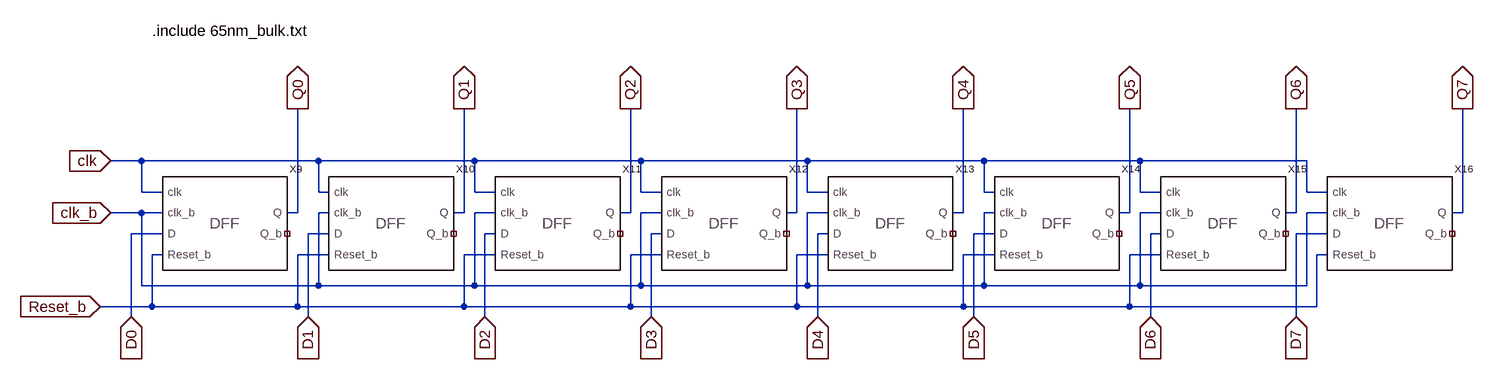
[diagram p0: schematic pipo_reg_new.asc]
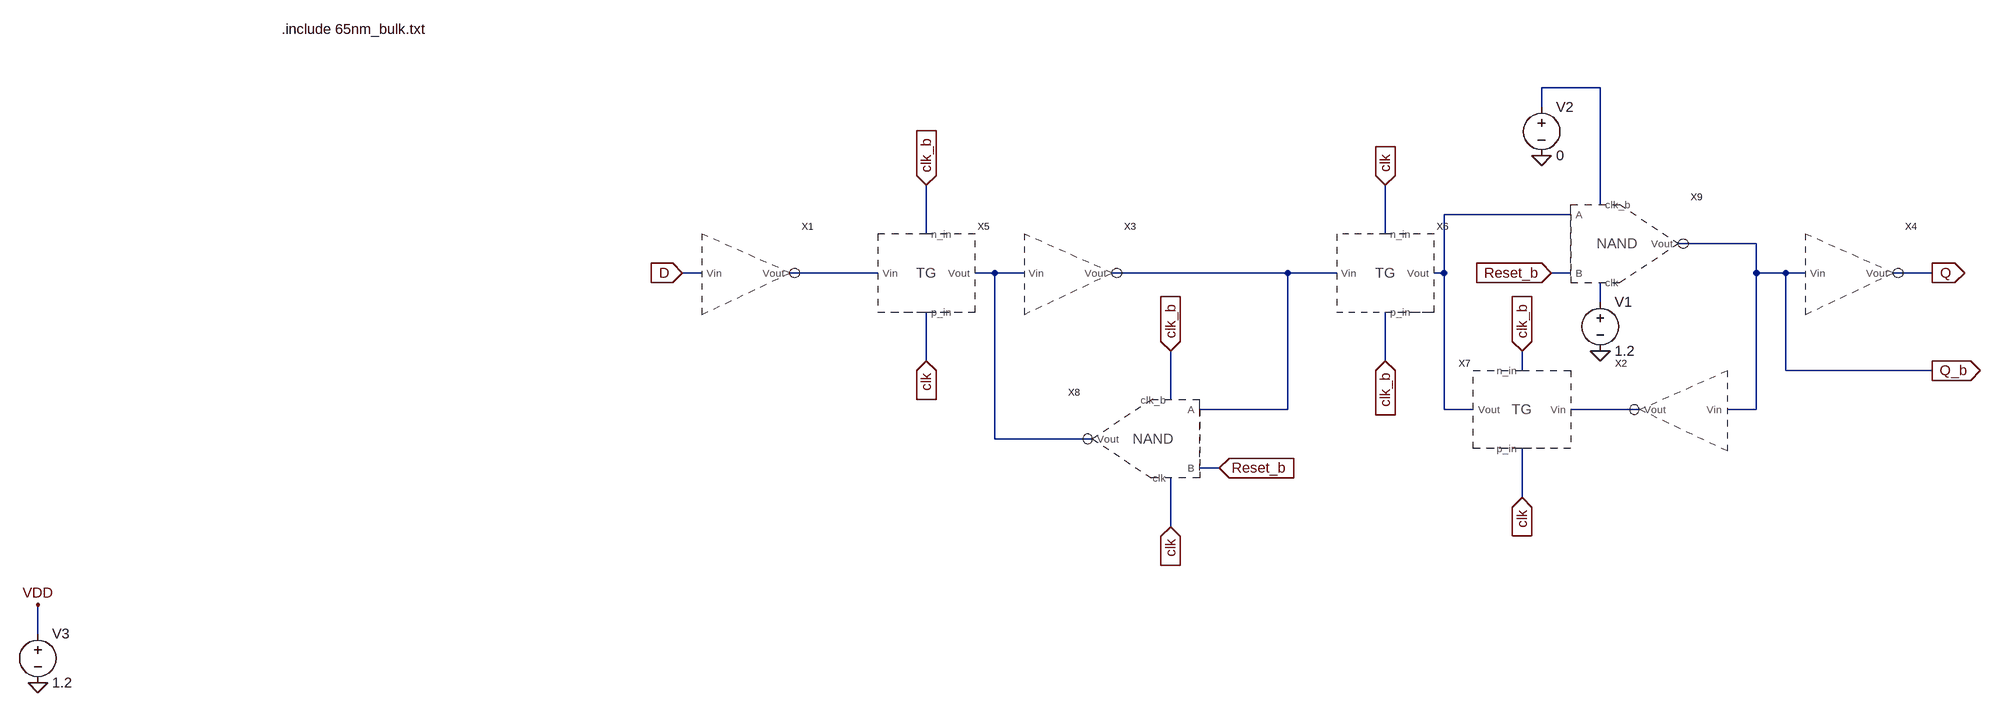
[diagram p1: sub-circuit def_res_sym_2.asc]
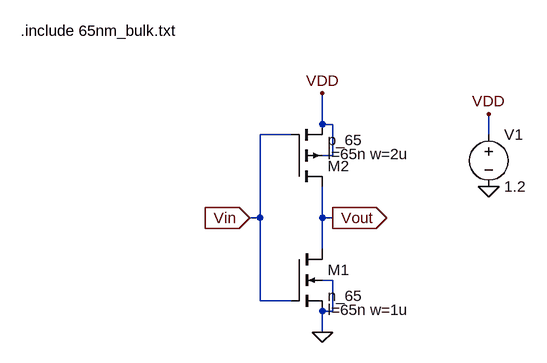
[diagram p2: sub-circuit inverter.asc]
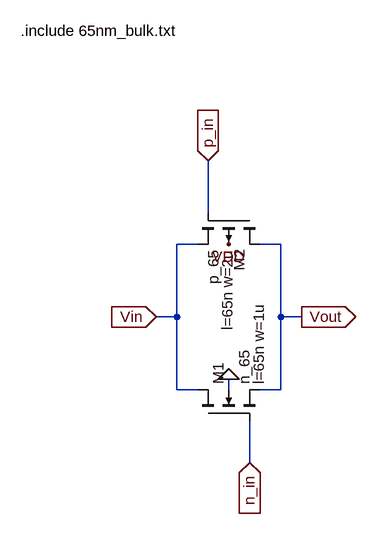
[diagram p3: sub-circuit transmission_gate.asc]
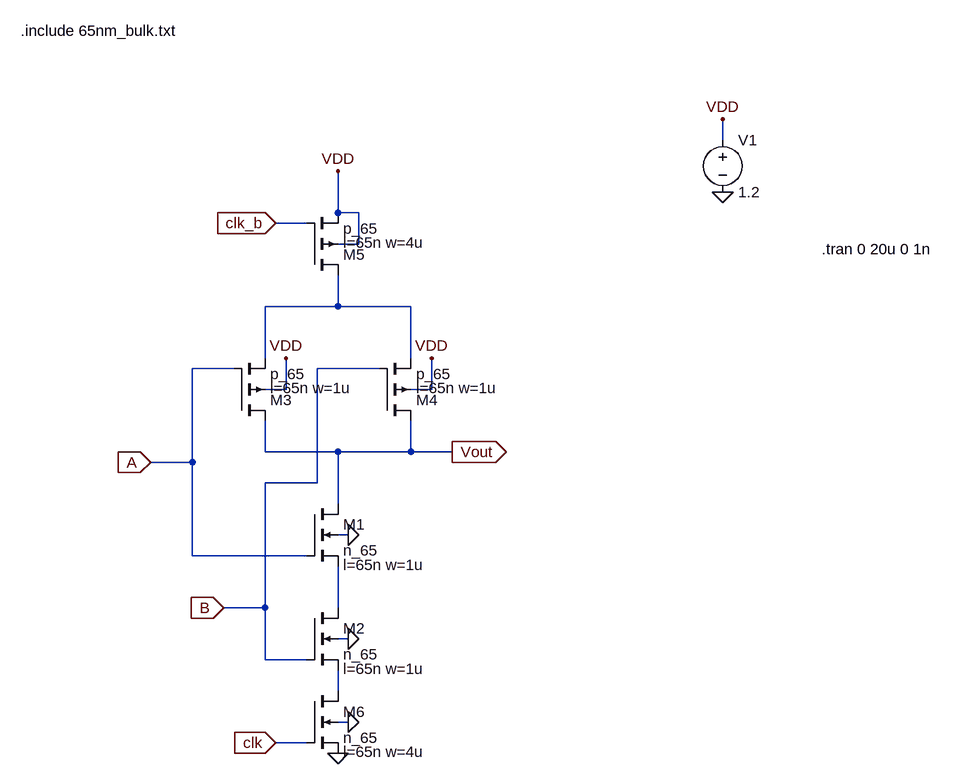
[diagram p4: sub-circuit nand_sym.asc]
pipo_reg_new.asc, the LTspice schematic file:
Version 4
SHEET 1 1628 704
WIRE -464 384 -512 384
WIRE -192 384 -464 384
WIRE 48 384 -192 384
WIRE 304 384 48 384
WIRE 560 384 304 384
WIRE 832 384 560 384
WIRE 1072 384 832 384
WIRE 1328 384 1072 384
WIRE -464 432 -464 384
WIRE -432 432 -464 432
WIRE -192 432 -192 384
WIRE -176 432 -192 432
WIRE 48 432 48 384
WIRE 80 432 48 432
WIRE 304 432 304 384
WIRE 336 432 304 432
WIRE 560 432 560 384
WIRE 592 432 560 432
WIRE 832 432 832 384
WIRE 848 432 832 432
WIRE 1072 432 1072 384
WIRE 1104 432 1072 432
WIRE 1328 432 1328 384
WIRE 1360 432 1328 432
WIRE -464 464 -512 464
WIRE -432 464 -464 464
WIRE -224 464 -224 304
WIRE -224 464 -240 464
WIRE -176 464 -192 464
WIRE 32 464 32 304
WIRE 32 464 16 464
WIRE 80 464 48 464
WIRE 288 464 288 304
WIRE 288 464 272 464
WIRE 336 464 304 464
WIRE 544 464 544 304
WIRE 544 464 528 464
WIRE 592 464 560 464
WIRE 800 464 800 304
WIRE 800 464 784 464
WIRE 848 464 832 464
WIRE 1056 464 1056 304
WIRE 1056 464 1040 464
WIRE 1104 464 1072 464
WIRE 1312 464 1312 304
WIRE 1312 464 1296 464
WIRE 1360 464 1328 464
WIRE 1568 464 1568 304
WIRE 1568 464 1552 464
WIRE -432 496 -480 496
WIRE -176 496 -208 496
WIRE 80 496 64 496
WIRE 336 496 320 496
WIRE 592 496 576 496
WIRE 848 496 816 496
WIRE 1104 496 1088 496
WIRE 1360 496 1312 496
WIRE -432 528 -448 528
WIRE -176 528 -224 528
WIRE 80 528 32 528
WIRE 336 528 288 528
WIRE 592 528 544 528
WIRE 848 528 800 528
WIRE 1104 528 1056 528
WIRE 1360 528 1344 528
WIRE -464 576 -464 464
WIRE -192 576 -192 464
WIRE -192 576 -464 576
WIRE 48 576 48 464
WIRE 48 576 -192 576
WIRE 304 576 304 464
WIRE 304 576 48 576
WIRE 560 576 560 464
WIRE 560 576 304 576
WIRE 832 576 832 464
WIRE 832 576 560 576
WIRE 1072 576 1072 464
WIRE 1072 576 832 576
WIRE 1328 576 1328 464
WIRE 1328 576 1072 576
WIRE -448 608 -448 528
WIRE -448 608 -528 608
WIRE -224 608 -224 528
WIRE -224 608 -448 608
WIRE 32 608 32 528
WIRE 32 608 -224 608
WIRE 288 608 288 528
WIRE 288 608 32 608
WIRE 544 608 544 528
WIRE 544 608 288 608
WIRE 800 608 800 528
WIRE 800 608 544 608
WIRE 1056 608 1056 528
WIRE 1056 608 800 608
WIRE 1344 608 1344 528
WIRE 1344 608 1056 608
WIRE -480 624 -480 496
WIRE -208 624 -208 496
WIRE 64 624 64 496
WIRE 320 624 320 496
WIRE 576 624 576 496
WIRE 816 624 816 496
WIRE 1088 624 1088 496
WIRE 1312 624 1312 496
FLAG -480 624 D0
IOPIN -480 624 In
FLAG -208 624 D1
IOPIN -208 624 In
FLAG 64 624 D2
IOPIN 64 624 In
FLAG 320 624 D3
IOPIN 320 624 In
FLAG 576 624 D4
IOPIN 576 624 In
FLAG 816 624 D5
IOPIN 816 624 In
FLAG 1088 624 D6
IOPIN 1088 624 In
FLAG 1312 624 D7
IOPIN 1312 624 In
FLAG -224 304 Q0
IOPIN -224 304 Out
FLAG 32 304 Q1
IOPIN 32 304 Out
FLAG 288 304 Q2
IOPIN 288 304 Out
FLAG 544 304 Q3
IOPIN 544 304 Out
FLAG 800 304 Q4
IOPIN 800 304 Out
FLAG 1056 304 Q5
IOPIN 1056 304 Out
FLAG 1312 304 Q6
IOPIN 1312 304 Out
FLAG 1568 304 Q7
IOPIN 1568 304 Out
FLAG -512 384 clk
IOPIN -512 384 In
FLAG -512 464 clk_b
IOPIN -512 464 In
FLAG -528 608 Reset_b
IOPIN -528 608 In
SYMBOL def_res_sym_2 -336 480 R0
SYMATTR InstName X9
SYMBOL def_res_sym_2 -80 480 R0
SYMATTR InstName X10
SYMBOL def_res_sym_2 176 480 R0
SYMATTR InstName X11
SYMBOL def_res_sym_2 432 480 R0
SYMATTR InstName X12
SYMBOL def_res_sym_2 688 480 R0
SYMATTR InstName X13
SYMBOL def_res_sym_2 944 480 R0
SYMATTR InstName X14
SYMBOL def_res_sym_2 1200 480 R0
SYMATTR InstName X15
SYMBOL def_res_sym_2 1456 480 R0
SYMATTR InstName X16
TEXT -448 184 Left 2 !.include 65nm_bulk.txt

def_res_sym_2.asc, the sub-circuit schematic file:
Version 4
SHEET 1 1980 960
WIRE 1344 -32 1248 -32
WIRE 1248 0 1248 -32
WIRE 1344 160 1344 -32
WIRE 1296 176 1088 176
WIRE 240 208 240 128
WIRE 992 208 992 128
WIRE 1600 224 1472 224
WIRE -128 272 -160 272
WIRE 160 272 16 272
WIRE 352 272 320 272
WIRE 400 272 352 272
WIRE 832 272 544 272
WIRE 912 272 832 272
WIRE 1088 272 1088 176
WIRE 1088 272 1072 272
WIRE 1296 272 1264 272
WIRE 1600 272 1600 224
WIRE 1648 272 1600 272
WIRE 1680 272 1648 272
WIRE 1888 272 1824 272
WIRE 1344 320 1344 288
WIRE 240 416 240 336
WIRE 992 416 992 336
WIRE 1216 432 1216 400
WIRE 1648 432 1648 272
WIRE 1888 432 1648 432
WIRE 640 480 640 400
WIRE 832 496 832 272
WIRE 832 496 688 496
WIRE 1088 496 1088 272
WIRE 1136 496 1088 496
WIRE 1408 496 1296 496
WIRE 1600 496 1600 272
WIRE 1600 496 1552 496
WIRE 352 544 352 272
WIRE 512 544 352 544
WIRE 720 592 688 592
WIRE 1216 640 1216 560
WIRE 640 688 640 608
WIRE -1216 864 -1216 816
FLAG 240 128 clk_b
IOPIN 240 128 In
FLAG 240 416 clk
IOPIN 240 416 In
FLAG 992 128 clk
IOPIN 992 128 In
FLAG 992 416 clk_b
IOPIN 992 416 In
FLAG 1216 400 clk_b
IOPIN 1216 400 In
FLAG 1216 640 clk
IOPIN 1216 640 In
FLAG -160 272 D
IOPIN -160 272 In
FLAG 1888 272 Q
IOPIN 1888 272 Out
FLAG 640 688 clk
IOPIN 640 688 In
FLAG 640 400 clk_b
IOPIN 640 400 In
FLAG 720 592 Reset_b
IOPIN 720 592 In
FLAG 1264 272 Reset_b
IOPIN 1264 272 In
FLAG 1344 400 0
FLAG 1248 80 0
FLAG -1216 816 VDD
FLAG -1216 944 0
FLAG 1888 432 Q_b
IOPIN 1888 432 Out
SYMBOL inverter -64 272 R0
SYMATTR InstName X1
SYMBOL inverter 1488 496 M0
SYMATTR InstName X2
SYMBOL inverter 464 272 R0
SYMATTR InstName X3
SYMBOL inverter 1744 272 R0
SYMATTR InstName X4
SYMBOL transmission_gate 240 272 R0
SYMATTR InstName X5
SYMBOL transmission_gate 992 272 R0
SYMATTR InstName X6
SYMBOL transmission_gate 1216 496 M0
SYMATTR InstName X7
SYMBOL nand_sym 608 544 M0
SYMATTR InstName X8
SYMBOL nand_sym 1376 224 R0
SYMATTR InstName X9
SYMBOL Voltage 1344 304 R0
SYMATTR InstName V1
SYMATTR Value 1.2
SYMBOL Voltage 1248 -16 R0
SYMATTR InstName V2
SYMATTR Value 0
SYMBOL Voltage -1216 848 R0
SYMATTR InstName V3
SYMATTR Value 1.2
TEXT -816 -128 Left 2 !.include 65nm_bulk.txt

inverter.asc, the sub-circuit schematic file:
Version 4
SHEET 1 880 680
WIRE 400 224 400 176
WIRE 416 224 400 224
WIRE 352 240 304 240
WIRE 656 240 656 208
WIRE 416 272 416 224
WIRE 416 272 400 272
WIRE 304 368 304 240
WIRE 304 368 288 368
WIRE 400 368 400 320
WIRE 416 368 400 368
WIRE 400 416 400 368
WIRE 416 464 400 464
WIRE 304 496 304 368
WIRE 352 496 304 496
WIRE 416 512 416 464
WIRE 416 512 400 512
WIRE 400 544 400 512
FLAG 400 544 0
FLAG 400 176 VDD
FLAG 656 208 VDD
FLAG 656 320 0
FLAG 288 368 Vin
IOPIN 288 368 In
FLAG 416 368 Vout
IOPIN 416 368 Out
SYMBOL nmos4 352 416 R0
WINDOW 123 56 94 Left 2
SYMATTR InstName M1
SYMATTR Value n_65
SYMATTR Value2 l=65n w=1u
SYMBOL pmos4 352 320 M180
WINDOW 123 56 50 Left 2
SYMATTR InstName M2
SYMATTR Value p_65
SYMATTR Value2 l=65n w=2u
SYMBOL Voltage 656 224 R0
SYMATTR InstName V1
SYMATTR Value 1.2
TEXT -64 80 Left 2 !.include 65nm_bulk.txt

transmission_gate.asc, the sub-circuit schematic file:
Version 4
SHEET 1 880 924
WIRE 64 368 64 288
WIRE 48 416 16 416
WIRE 176 416 144 416
WIRE 16 528 16 416
WIRE 16 528 -16 528
WIRE 176 528 176 416
WIRE 208 528 176 528
WIRE 16 640 16 528
WIRE 48 640 16 640
WIRE 96 640 96 624
WIRE 176 640 176 528
WIRE 176 640 144 640
WIRE 128 752 128 688
FLAG 96 624 0
FLAG 96 416 VDD
FLAG 128 752 n_in
IOPIN 128 752 In
FLAG 64 288 p_in
IOPIN 64 288 In
FLAG -16 528 Vin
IOPIN -16 528 In
FLAG 208 528 Vout
IOPIN 208 528 Out
SYMBOL nmos4 48 688 R270
WINDOW 123 56 94 Left 2
SYMATTR Value2 l=65n w=1u
SYMATTR InstName M1
SYMATTR Value n_65
SYMBOL pmos4 144 368 R90
WINDOW 123 56 50 Left 2
SYMATTR Value2 l=65n w=2u
SYMATTR InstName M2
SYMATTR Value p_65
TEXT -224 88 Left 2 !.include 65nm_bulk.txt

nand_sym.asc, the sub-circuit schematic file:
Version 4
SHEET 1 1728 992
WIRE 592 -240 592 -272
WIRE 0 -128 0 -192
WIRE 32 -128 0 -128
WIRE -48 -112 -96 -112
WIRE 32 -80 32 -128
WIRE 32 -80 0 -80
WIRE 0 16 0 -32
WIRE 0 16 -112 16
WIRE 112 16 0 16
WIRE -112 96 -112 16
WIRE 112 96 112 16
WIRE -160 112 -224 112
WIRE 64 112 -32 112
WIRE -80 144 -80 96
WIRE -80 144 -112 144
WIRE 144 144 144 96
WIRE 144 144 112 144
WIRE -112 240 -112 192
WIRE 0 240 -112 240
WIRE 112 240 112 192
WIRE 112 240 0 240
WIRE 176 240 112 240
WIRE -224 256 -224 112
WIRE -224 256 -288 256
WIRE -32 288 -32 112
WIRE -32 288 -112 288
WIRE 0 320 0 240
WIRE 16 368 0 368
WIRE -224 400 -224 256
WIRE -48 400 -224 400
WIRE -112 480 -112 288
WIRE -112 480 -176 480
WIRE 0 480 0 416
WIRE 16 528 0 528
WIRE -112 560 -112 480
WIRE -48 560 -112 560
WIRE 0 608 0 576
WIRE 16 656 0 656
WIRE -48 688 -96 688
FLAG 0 -192 VDD
FLAG 16 368 0
FLAG 16 528 0
FLAG -288 256 A
IOPIN -288 256 In
FLAG -176 480 B
IOPIN -176 480 In
FLAG -80 96 VDD
FLAG 144 96 VDD
FLAG 16 656 0
FLAG 0 704 0
FLAG -96 -112 clk_b
IOPIN -96 -112 In
FLAG -96 688 clk
IOPIN -96 688 In
FLAG 176 240 Vout
IOPIN 176 240 Out
FLAG 592 -272 VDD
FLAG 592 -160 0
SYMBOL nmos4 -48 320 R0
WINDOW 123 56 94 Left 2
SYMATTR Value2 l=65n w=1u
SYMATTR InstName M1
SYMATTR Value n_65
SYMBOL nmos4 -48 480 R0
WINDOW 123 56 94 Left 2
SYMATTR Value2 l=65n w=1u
SYMATTR InstName M2
SYMATTR Value n_65
SYMBOL pmos4 -160 192 M180
WINDOW 123 56 50 Left 2
SYMATTR Value2 l=65n w=1u
SYMATTR InstName M3
SYMATTR Value p_65
SYMBOL pmos4 64 192 M180
WINDOW 123 56 50 Left 2
SYMATTR Value2 l=65n w=1u
SYMATTR InstName M4
SYMATTR Value p_65
SYMBOL pmos4 -48 -32 M180
WINDOW 123 56 50 Left 2
SYMATTR Value2 l=65n w=4u
SYMATTR InstName M5
SYMATTR Value p_65
SYMBOL nmos4 -48 608 R0
WINDOW 123 56 94 Left 2
SYMATTR Value2 l=65n w=4u
SYMATTR InstName M6
SYMATTR Value n_65
SYMBOL Voltage 592 -256 R0
SYMATTR InstName V1
SYMATTR Value 1.2
TEXT -488 -408 Left 2 !.include 65nm_bulk.txt
TEXT 744 -72 Left 2 !.tran 0 20u 0 1n

The netlist it stands for:
* pipo_reg_new.asc
XX9 clk clk_b D0 Reset_b Q0 NC_01 def_res_sym_2
XX10 clk clk_b D1 Reset_b Q1 NC_02 def_res_sym_2
XX11 clk clk_b D2 Reset_b Q2 NC_03 def_res_sym_2
XX12 clk clk_b D3 Reset_b Q3 NC_04 def_res_sym_2
XX13 clk clk_b D4 Reset_b Q4 NC_05 def_res_sym_2
XX14 clk clk_b D5 Reset_b Q5 NC_06 def_res_sym_2
XX15 clk clk_b D6 Reset_b Q6 NC_07 def_res_sym_2
XX16 clk clk_b D7 Reset_b Q7 NC_08 def_res_sym_2

* block symbol definitions
.subckt def_res_sym_2 clk clk_b D Reset_b Q Q_b
XX1 D N003 inverter
XX2 Q_b N007 inverter
XX3 N004 N005 inverter
XX4 Q_b Q inverter
XX5 clk_b clk N003 N004 transmission_gate
XX6 clk clk_b N005 N002 transmission_gate
XX7 clk_b clk N007 N002 transmission_gate
XX8 N005 Reset_b clk clk_b N004 nand_sym
XX9 N002 Reset_b N006 N001 Q_b nand_sym
V1 N006 0 1.2
V2 N001 0 0
V3 VDD 0 1.2
.include 65nm_bulk.txt
.ends def_res_sym_2

.subckt inverter Vin Vout
M1 Vout Vin 0 0 n_65 l=65n w=1u
M2 Vout Vin VDD VDD p_65 l=65n w=2u
V1 VDD 0 1.2
.include 65nm_bulk.txt
.ends inverter

.subckt transmission_gate n_in p_in Vin Vout
M1 Vin n_in Vout 0 n_65 l=65n w=1u
M2 Vout p_in Vin VDD p_65 l=65n w=2u
.include 65nm_bulk.txt
.ends transmission_gate

.subckt nand_sym A B clk clk_b Vout
M1 Vout A N002 0 n_65 l=65n w=1u
M2 N002 B N003 0 n_65 l=65n w=1u
M3 Vout A N001 VDD p_65 l=65n w=1u
M4 Vout B N001 VDD p_65 l=65n w=1u
M5 N001 clk_b VDD VDD p_65 l=65n w=4u
M6 N003 clk 0 0 n_65 l=65n w=4u
V1 VDD 0 1.2
.include 65nm_bulk.txt
.tran 0 20u 0 1n
.ends nand_sym

.model NMOS NMOS
.model PMOS PMOS
.lib standard.mos
.include 65nm_bulk.txt
.backanno
.end